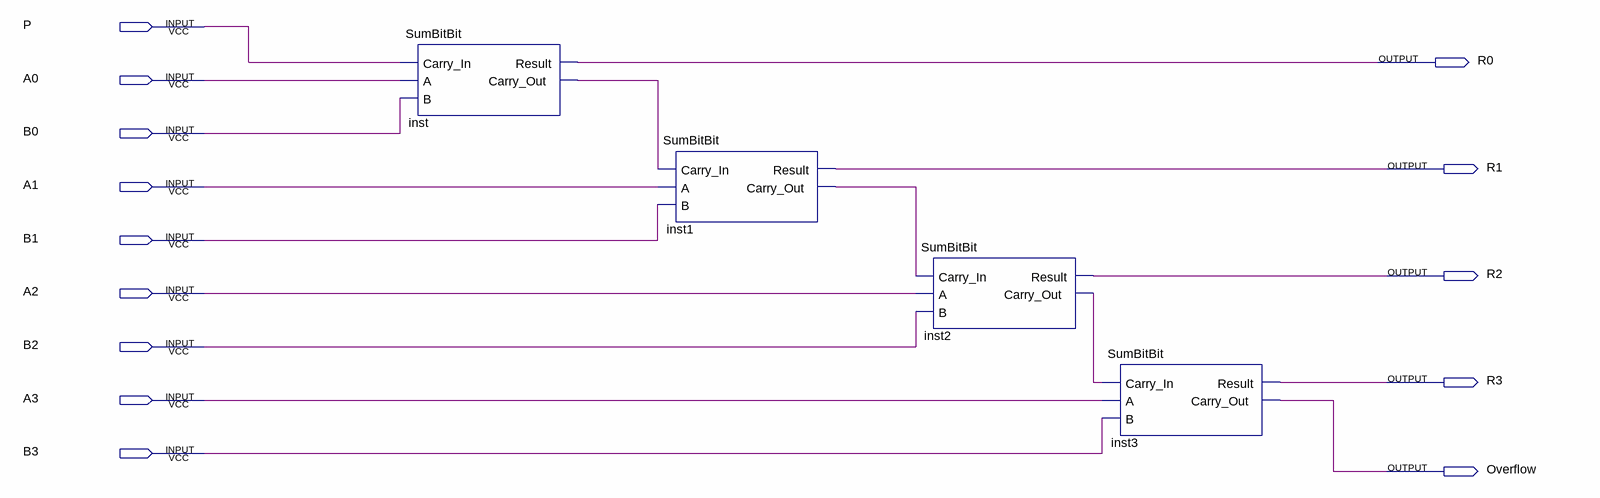
[diagram p0: schematic sheet]
// Quartus schematic Sum4Bit.bdf as structural Verilog: 4 symbols, 14 pins
module Sum4Bit (
  input  P,
  input  A0,
  input  B0,
  input  A1,
  input  B1,
  input  A2,
  input  B2,
  input  A3,
  input  B3,
  output R0,
  output R1,
  output R2,
  output R3,
  output Overflow
);

  wire inst1_carry_out, inst2_carry_out, inst_carry_out;

  SumBitBit inst (.Carry_In(P), .A(A0), .B(B0), .Result(R0), .Carry_Out(inst_carry_out));
  SumBitBit inst1 (.Carry_In(inst_carry_out), .A(A1), .B(B1), .Result(R1), .Carry_Out(inst1_carry_out));
  SumBitBit inst2 (.Carry_In(inst1_carry_out), .A(A2), .B(B2), .Result(R2), .Carry_Out(inst2_carry_out));
  SumBitBit inst3 (.Carry_In(inst2_carry_out), .A(A3), .B(B3), .Result(R3), .Carry_Out(Overflow));
endmodule
